# EAGLE design AntennaControl (EAGLE 4.16)
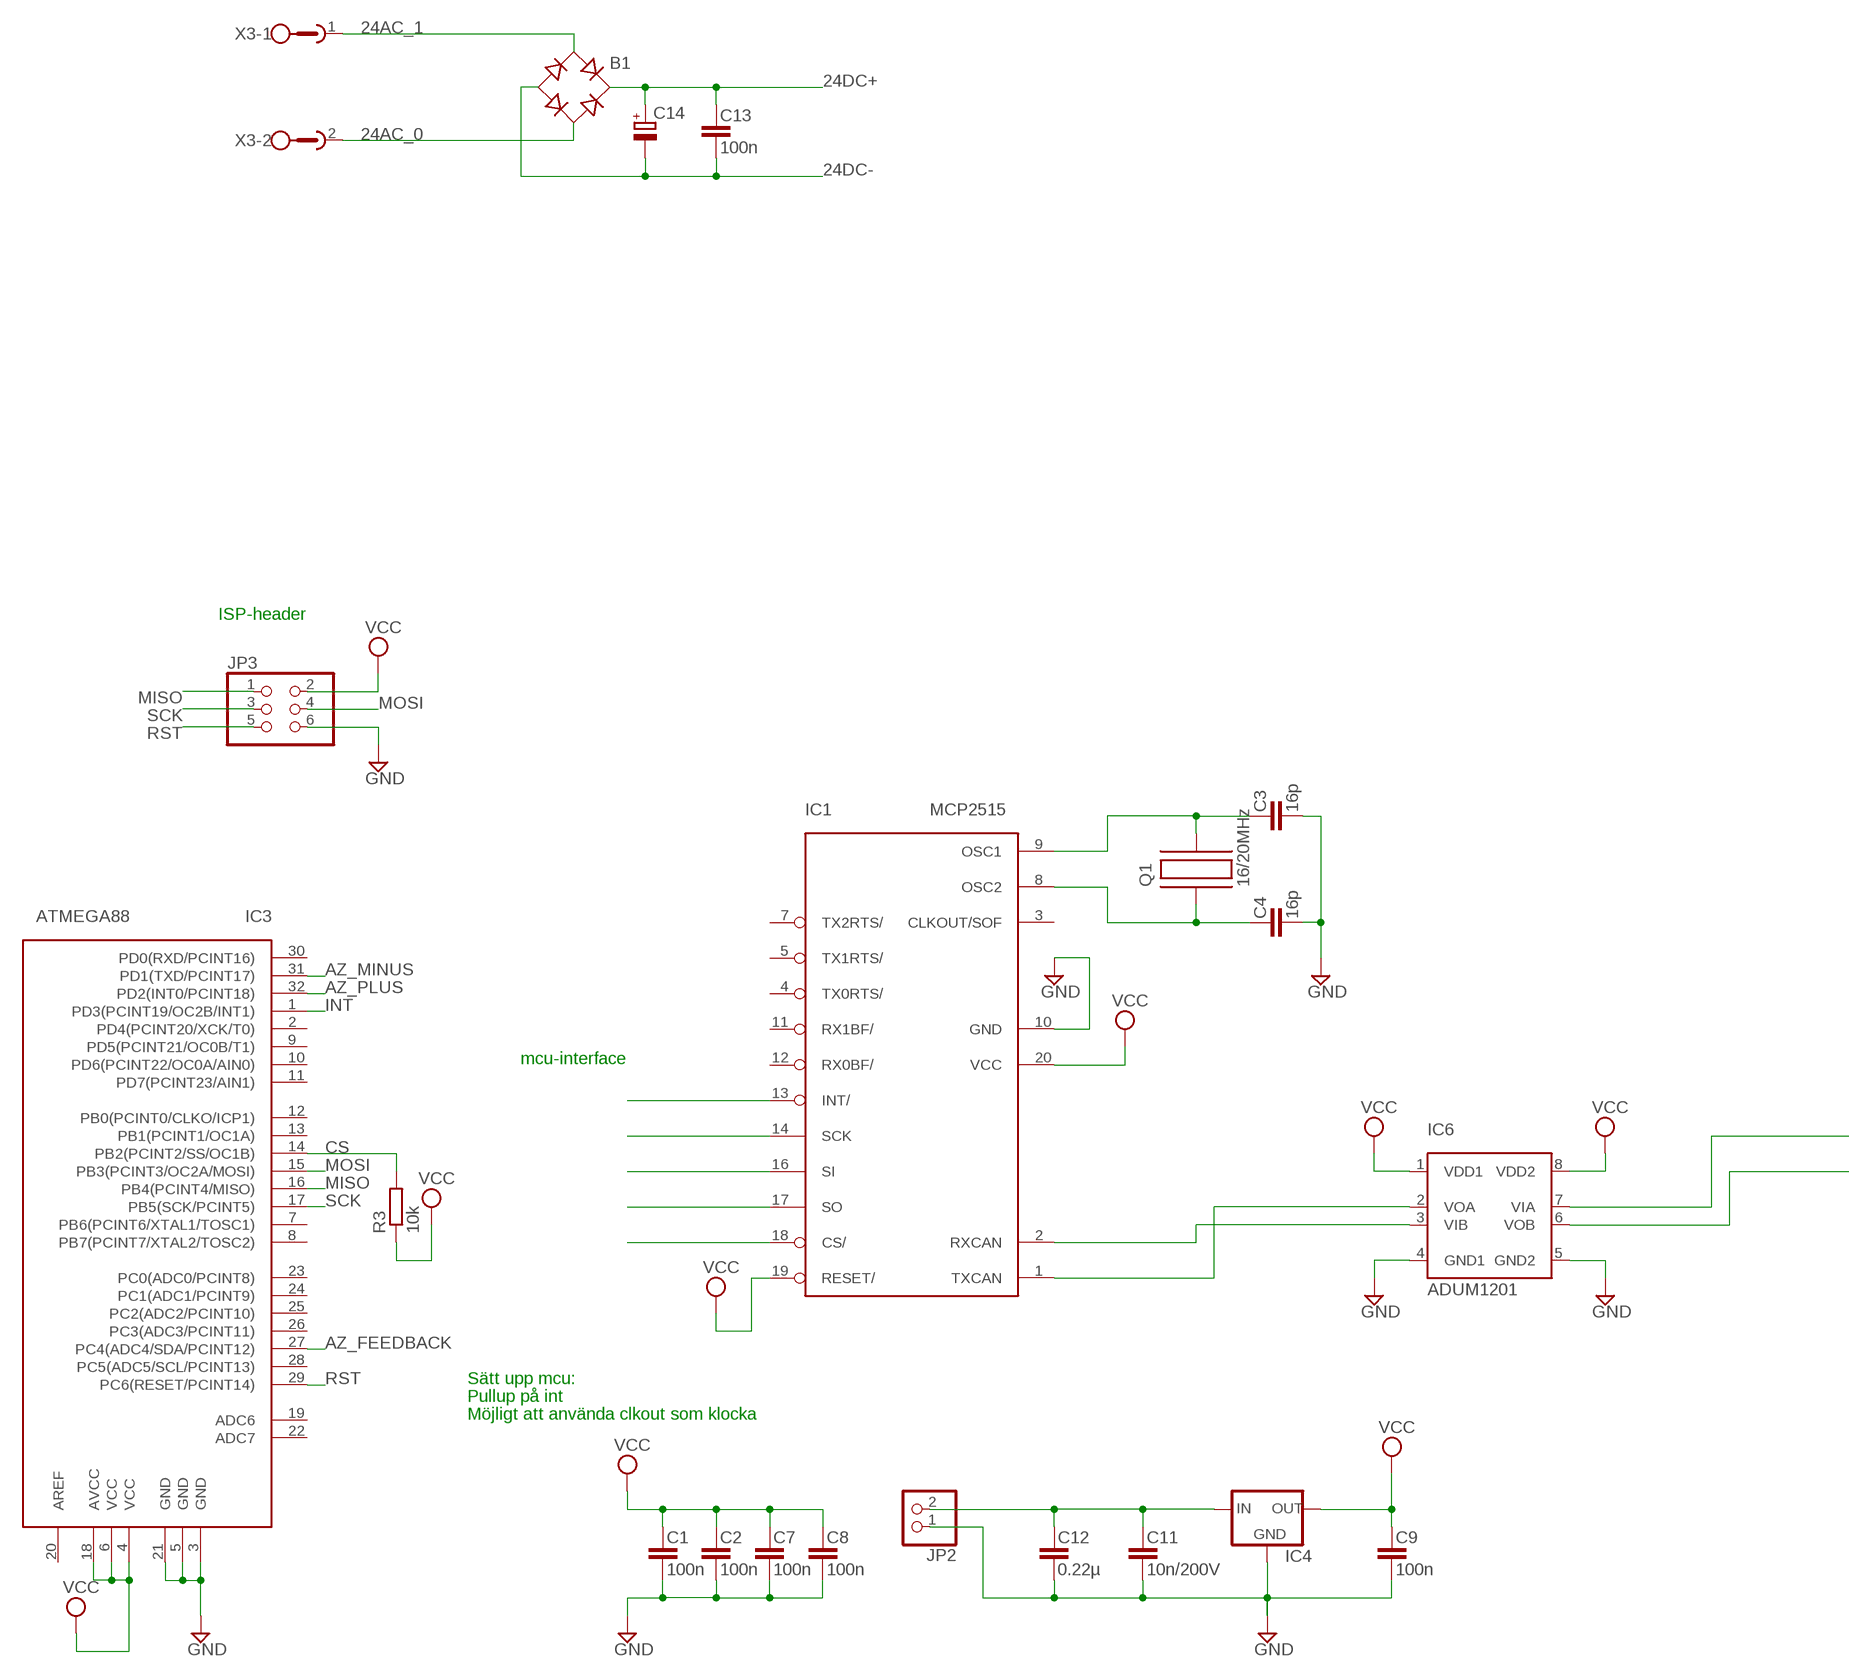
[diagram p0: schematic, sheet 1, part 1 of 2]
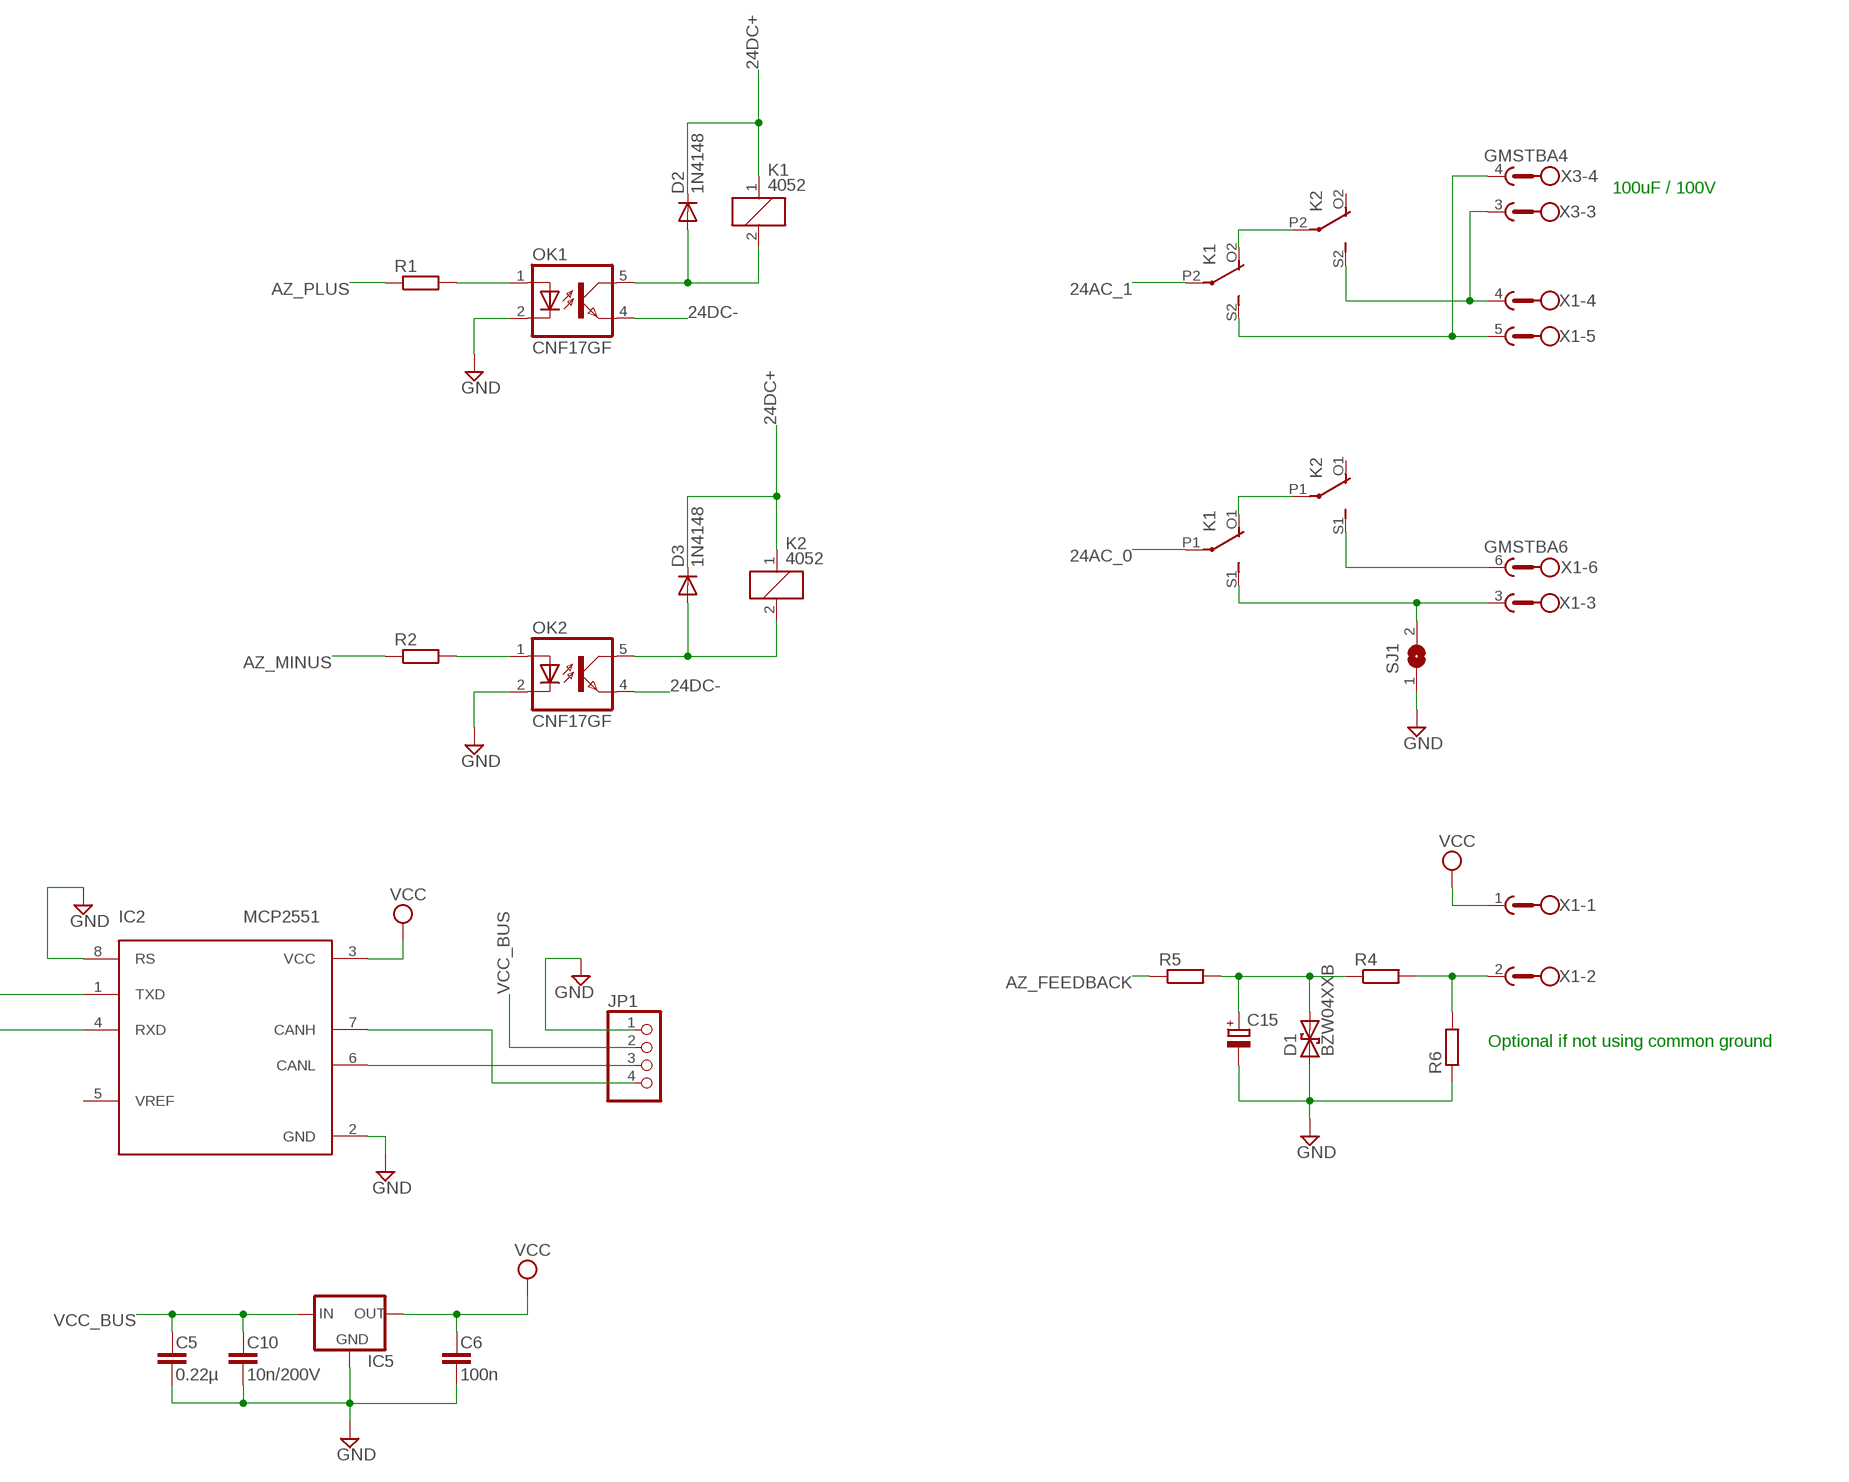
[diagram p1: schematic, sheet 1, part 2 of 2]

## Parts
B1  RB1A  [RB1A]
C1  100n  C-EU  [C0603]
C2  100n  C-EU  [C0603]
C3  16p  C-EU  [C0603]
C4  16p  C-EU  [C0603]
C5  0.22µ  C-EU  [C0603]
C6  100n  C-EU  [C0603]
C7  100n  C-EU  [C0603]
C8  100n  C-EU  [C0603]
C9  100n  C-EU  [C0603]
C10  10n/200V  C-EU  [C0603]
C11  10n/200V  C-EU  [C0603]
C12  0.22µ  C-EU  [C0603]
C13  100n  C-EU  [C0603]
C14  CPOL-EUE2.5-6  [E2,5-6]
C15  CPOL-EUE2.5-6  [E2,5-6]
D1  BZW04XXB  [F126Z12]
D2  1N4148  [DO35-10]
D3  1N4148  [DO35-10]
IC1  MCP2515  [TSSOP]
IC2  MCP2551  [SOIC]
IC3  ATMEGA88  [TQFP32]
IC4  78XXS  [78XXS]
IC5  78XXS  [78XXS]
IC6  ADUM1201  [SOIC]
JP1  PINHD-1X4  [1X04]
JP2  PINHD-1X2  [1X02]
JP3  PINHD-2X3  [2X03]
K1  4052  [F4052]
K2  4052  [F4052]
OK1  CNF17GF  [DIL06B]
OK2  CNF17GF  [DIL06B]
Q1  16/20MHz  C-MAC-LFA147E  [SMD]
R1  R-EU_R0603  [R0603]
R2  R-EU_R0603  [R0603]
R3  10k  R-EUR0603  [R0603@1]
R4  R-EU_R0603  [R0603]
R5  R-EU_R0603  [R0603]
R6  R-EU_R0603  [R0603]
SJ1  SJ  [SJ]
X1  GMSTBA6  [GMSTBA6]
X3  GMSTBA4  [GMSTBA4]

## Nets
24AC_0: B1.AC2 K1.P1(2:P) X3.2
24AC_1: B1.AC1 K1.P2(3:P) X3.1
24DC+: B1.+ C13.1 C14.+ D2.C D3.C K1.1 K2.1
24DC-: B1.- C13.2 C14.- OK1.4(EMIT) OK2.4(EMIT)
AZ_FEEDBACK: IC3.27(PC4(ADC4/SDA/PCINT12)) R5.1
AZ_MINUS: IC3.31(PD1(TXD/PCINT17)) R2.1
AZ_PLUS: IC3.32(PD2(INT0/PCINT18)) R1.1
CANH: IC2.7(CANH) JP1.4
CANL: IC2.6(CANL) JP1.3
CS: IC1.18(CS/) IC3.14(PB2(PCINT2/SS/OC1B)) R3.2
GND: C1.2 C2.2 C3.2 C4.2 C7.2 C8.2 C9.2 C11.2 C12.2 C15.- D1.A IC1.10(GND) IC3.3(GND) IC3.5(GND) IC3.21(GND) IC4.GND IC6.4(GND1) JP2.1 JP3.6 OK1.2(C) OK2.2(C) R6.1 SJ1.1
GND_BUS: C5.2 C6.2 C10.2 IC2.2(GND) IC2.8(RS) IC5.GND IC6.5(GND2) JP1.1 ; supply symbol labelled GND
INT: IC1.13(INT/) IC3.1(PD3(PCINT19/OC2B/INT1))
MISO: IC1.17(SO) IC3.16(PB4(PCINT4/MISO)) JP3.1
MOSI: IC1.16(SI) IC3.15(PB3(PCINT3/OC2A/MOSI)) JP3.4
N$1: IC2.1(TXD) IC6.7(VIA)
N$2: IC2.4(RXD) IC6.6(VOB)
N$3: IC1.2(RXCAN) IC6.3(VIB)
N$4: IC1.1(TXCAN) IC6.2(VOA)
N$5: OK1.1(A) R1.2
N$6: OK2.1(A) R2.2
N$7: D3.A K2.2 OK2.5(COL)
N$8: D2.A K1.2 OK1.5(COL)
N$9: K1.O2(3:O) K2.P2(3:P)
N$10: K1.O1(2:O) K2.P1(2:P)
N$11: R4.2 R6.2 X1.2
N$12: C3.1 IC1.9(OSC1) Q1.P$2
N$13: C4.1 IC1.8(OSC2) Q1.P$1
N$15: K2.S2(3:S) X1.4 X3.3
N$16: K1.S2(3:S) X1.5 X3.4
N$17: K2.S1(2:S) X1.6
N$18: K1.S1(2:S) SJ1.2 X1.3
N$19: C15.+ D1.C R4.1 R5.2
RST: IC3.29(PC6(RESET/PCINT14)) JP3.5
SCK: IC1.14(SCK) IC3.17(PB5(SCK/PCINT5)) JP3.3
VCC: C6.1 IC2.3(VCC) IC5.OUT IC6.8(VDD2)
VCC_BUS: C5.1 C10.1 IC5.IN JP1.2
VCC_LOCAL: C11.1 C12.1 IC4.IN JP2.2
VCC_NODE: C1.1 C2.1 C7.1 C8.1 C9.1 IC1.19(RESET/) IC1.20(VCC) IC3.4(VCC) IC3.6(VCC) IC3.18(AVCC) IC4.OUT IC6.1(VDD1) JP3.2 R3.1 X1.1 ; supply symbol labelled VCC
Unconnected: IC1.3(CLKOUT/SOF) IC1.4(TX0RTS/) IC1.5(TX1RTS/) IC1.7(TX2RTS/) IC1.11(RX1BF/) IC1.12(RX0BF/) IC2.5(VREF) IC3.2(PD4(PCINT20/XCK/T0)) IC3.7(PB6(PCINT6/XTAL1/TOSC1)) IC3.8(PB7(PCINT7/XTAL2/TOSC2)) IC3.9(PD5(PCINT21/OC0B/T1)) IC3.10(PD6(PCINT22/OC0A/AIN0)) IC3.11(PD7(PCINT23/AIN1)) IC3.12(PB0(PCINT0/CLKO/ICP1)) IC3.13(PB1(PCINT1/OC1A)) IC3.19(ADC6) IC3.20(AREF) IC3.22(ADC7) IC3.23(PC0(ADC0/PCINT8)) IC3.24(PC1(ADC1/PCINT9)) IC3.25(PC2(ADC2/PCINT10)) IC3.26(PC3(ADC3/PCINT11)) IC3.28(PC5(ADC5/SCL/PCINT13)) IC3.30(PD0(RXD/PCINT16)) K2.O1(2:O) K2.O2(3:O)

## Notes on the sheet
- 100uF / 100V
- ISP-header
- mcu-interface
- Optional if not using common ground
- Sätt upp mcu:
- Pullup på int
- Möjligt att använda clkout som klocka

## Library data of the parts
B1 = rectifier:RB1A: RECTIFIER 1 A
C1-C13 = rcl:C-EU
C14 C15 = rcl:CPOL-EU: POLARIZED CAPACITOR, European symbol
D1 = diode:BZW04XXB: DIODE uni and bidirectional supressor diode
D2 D3 = diode:1N4148: DIODE high speed (Philips)
IC1 = mcp2515:MCP2515
IC2 = mcp2551:MCP2551
IC3 = atmega88:ATMEGA88
IC4 IC5 = v-reg:78XXS: VOLTAGE REGULATOR
IC6 = adum1201:ADUM1201
JP1 = pinhead:PINHD-1X4: PIN HEADER
JP2 = pinhead:PINHD-1X2: PIN HEADER
JP3 = pinhead:PINHD-2X3: PIN HEADER
K1 K2 = relay:4052: RELAY 2 x switch, Finder
OK1 OK2 = optocoupler:CNF17GF: HEWLETT PACKARD OPTO COUPLER
Q1 = hc49-4h-smx:C-MAC-LFA147E
R1 R2 R4-R6 = rcl:R-EU_: RESISTOR, European symbol
R3 = rcl:R-EU
SJ1 = jumper:SJ: SMD solder JUMPER
X1 = con-phoenix-508:GMSTBA6: PHOENIX
X3 = con-phoenix-508:GMSTBA4: PHOENIX

## Board
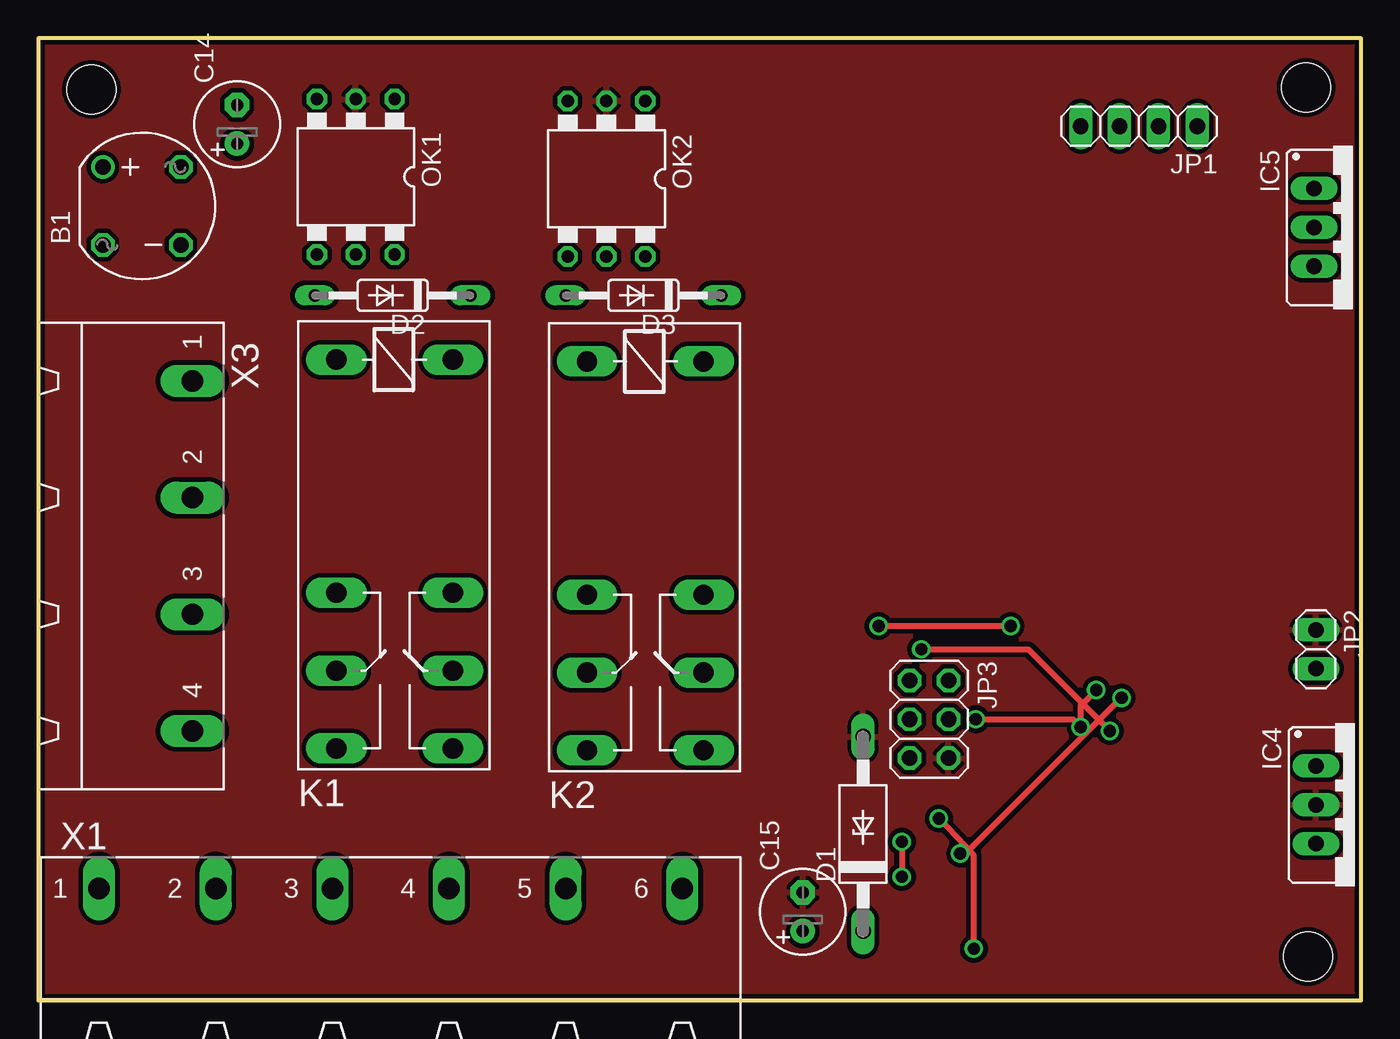
[diagram p2: board, top side]
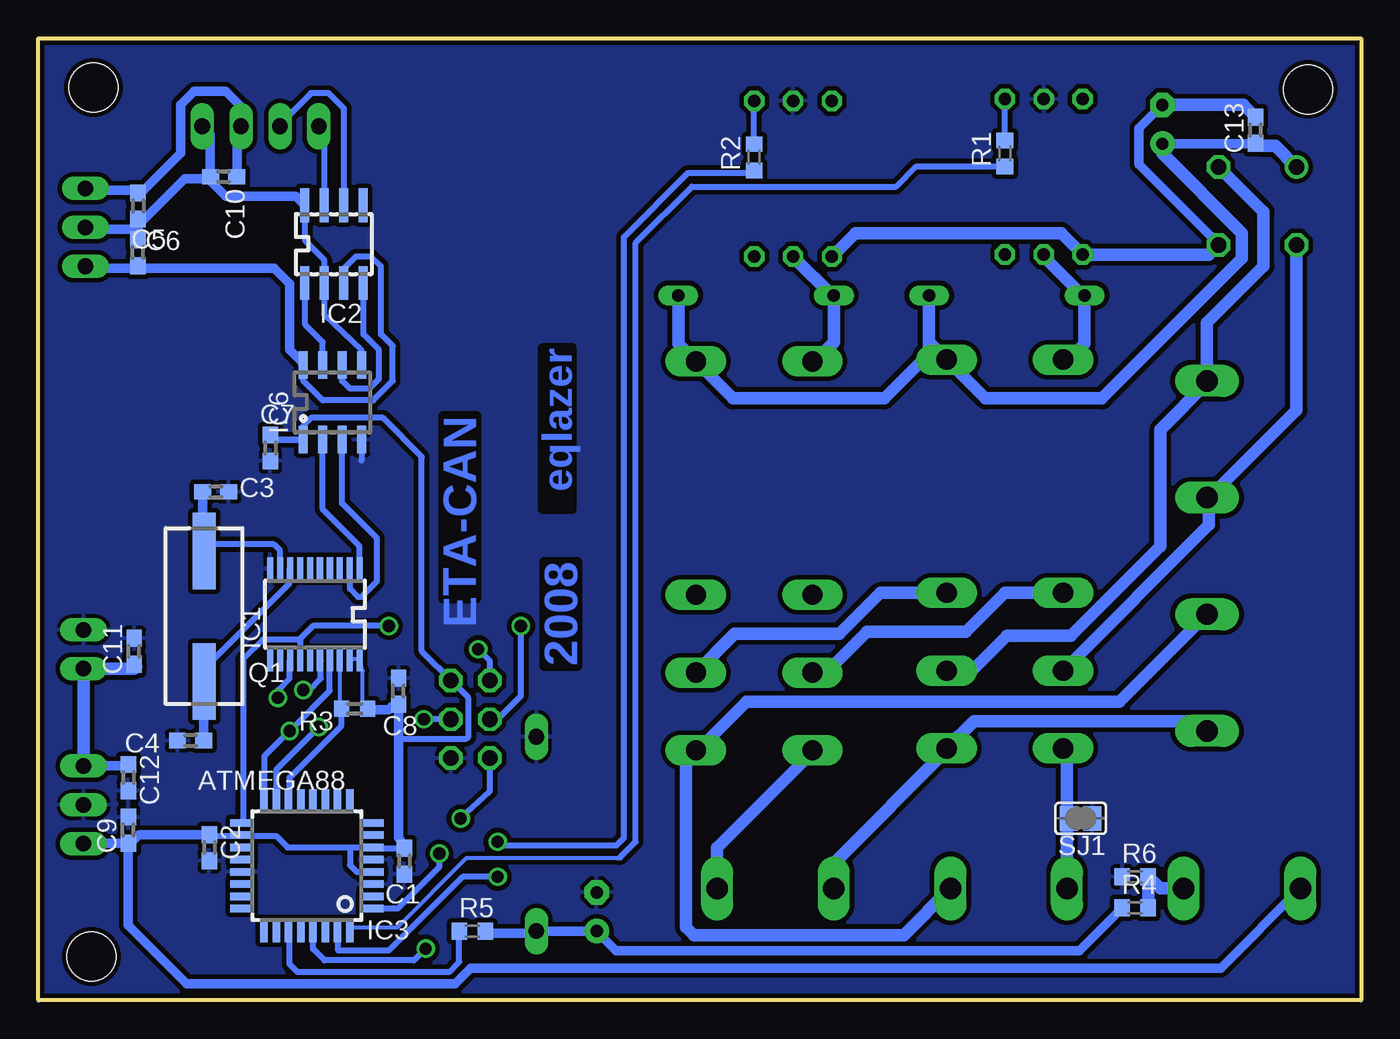
[diagram p3: board, bottom side, seen from below]

Size 86.44 x 62.85 mm. Coordinates in mm from the lower left corner, seen from the top.
Outline: 0,0 86.44,0 86.44,62.85 0,62.85 0,0
Copper layers (1*16): Top 0.035mm / dielectric 1.5mm / Bottom 0.035mm
Design rules "10mils, 0.6drill": minimum track width 10mil, minimum drill 0.6mm, track to track 10mil, track to pad 10mil, pad to pad 10mil, via to via 10mil, smd to smd 10mil, copper to edge 10mil, drill to drill 10mil, minimum pad ring 10mil, minimum via ring 8mil, stop-mask expansion 0mil, vias tented up to drill 0mil, thermal gap 10mil
Holes 3.2 mm at 3.47,59.51 82.85,59.64 82.97,2.87

### Footprints (pad centres in the part's own frame; a part is rotated, then mirrored left to right if it is on the bottom)
RB1A = drill 1.016 round: + -2.54,2.54 | drill 1.016 octagon: - 2.54,-2.54; AC1 2.54,2.54; AC2 -2.54,-2.54
C0603 = smd 1.1 x 1: 1 -0.85,0; 2 0.85,0
E2,5-6 = drill 0.813 pad 1.6 round: + -1.27,0 | drill 0.813 pad 1.6 octagon: - 1.27,0
F126Z12 = drill 1.016 long: A 6.35,0; C -6.35,0
DO35-10 = drill 0.813 long: A 5.08,0; C -5.08,0
TSSOP = smd 0.396 x 1.5: 1 -2.925,-2.975; 2 -2.275,-2.975; 3 -1.625,-2.975; 4 -0.975,-2.975; 5 -0.325,-2.975; 6 0.325,-2.975; 7 0.975,-2.975; 8 1.625,-2.975; 9 2.275,-2.975; 10 2.925,-2.975; 11 2.925,2.975; 12 2.275,2.975; 13 1.625,2.975; 14 0.975,2.975; 15 0.325,2.975; 16 -0.325,2.975; 17 -0.975,2.975; 18 -1.625,2.975; 19 -2.275,2.975; 20 -2.925,2.975
SOIC = smd 0.6 x 2.2: 1 -1.905,-2.54; 2 -0.635,-2.54; 3 0.635,-2.54; 4 1.905,-2.54; 5 1.905,2.54; 6 0.635,2.54; 7 -0.635,2.54; 8 -1.905,2.54
TQFP32 = smd 1.5 x 0.5: 1 -4.25,2.65; 2 -4.25,1.85; 3 -4.25,1.05; 4 -4.25,0.25; 5 -4.25,-0.55; 6 -4.25,-1.35; 7 -4.25,-2.15; 8 -4.25,-2.95; 17 4.25,-2.95; 18 4.25,-2.15; 19 4.25,-1.35; 20 4.25,-0.55; 21 4.25,0.25; 22 4.25,1.05; 23 4.25,1.85; 24 4.25,2.65 | smd 0.5 x 1.5: 9 -2.8,-4.4; 10 -2,-4.4; 11 -1.2,-4.4; 12 -0.4,-4.4; 13 0.4,-4.4; 14 1.2,-4.4; 15 2,-4.4; 16 2.8,-4.4; 25 2.8,4.1; 26 2,4.1; 27 1.2,4.1; 28 0.4,4.1; 29 -0.4,4.1; 30 -1.2,4.1; 31 -2,4.1; 32 -2.8,4.1
78XXS = drill 1.016 long: GND 0,-2.54; IN -2.54,-2.54; OUT 2.54,-2.54
SOIC' = smd 0.6 x 1.8: 1 -1.905,-2.44; 2 -0.635,-2.44; 3 0.635,-2.44; 4 1.905,-2.44; 5 1.905,2.44; 6 0.635,2.44; 7 -0.635,2.44; 8 -1.905,2.44
1X04 = drill 1.016 long: 1 -3.81,0; 2 -1.27,0; 3 1.27,0; 4 3.81,0
1X02 = drill 1.016 long: 1 -1.27,0; 2 1.27,0
2X03 = drill 1.016 octagon: 1 -2.54,-1.27; 2 -2.54,1.27; 3 0,-1.27; 4 0,1.27; 5 2.54,-1.27; 6 2.54,1.27
F4052 = drill 1.321 long: 1 -3.81,3.81; 2 -3.81,-3.81; O1 11.43,-3.81; O2 11.43,3.81; P1 16.51,-3.81; P2 16.51,3.81; S1 21.59,-3.81; S2 21.59,3.81
DIL06B = drill 0.813 octagon: 1 -2.54,-5.08; 2 0,-5.08; 3 2.54,-5.08; 4 2.54,5.08; 5 0,5.08; 6 -2.54,5.08
SMD = smd 5 x 1.5: P$1 4.25,0; P$2 -4.25,0
R0603 = smd 1 x 1.1: 1 -0.85,0; 2 0.85,0
R0603@1 = smd 0.991 x 1.016: 1 -0.85,0; 2 0.85,0
SJ = smd 1.168 x 1.6: 1 -0.762,0; 2 0.762,0
GMSTBA6 = drill 1.397 long: 1 -19.05,5.08; 2 -11.43,5.08; 3 -3.81,5.08; 4 3.81,5.08; 5 11.43,5.08; 6 19.05,5.08
GMSTBA4 = drill 1.397 long: 1 -11.43,5.08; 2 -3.81,5.08; 3 3.81,5.08; 4 11.43,5.08

### Placement (x,y rotation side)
B1  6.77,51.89 0 top
C1  62.53,9.09 270 bottom
C2  75.27,9.98 270 bottom
C3  74.84,33.22 0 bottom
C4  76.5,16.97 180 bottom
C5  79.92,51.89 270 bottom
C6  79.92,48.85 90 bottom
C7  71.28,36.08 270 bottom
C8  62.9,20.2 90 bottom
C9  80.56,11.13 90 bottom
C10  74.34,53.8 180 bottom
C11  80.18,22.81 90 bottom
C12  80.56,14.56 270 bottom
C13  6.9,56.85 90 bottom
C14  13,57.23 90 top
C15  49.95,5.79 90 top
D1  53.89,10.87 90 top
D2  23.16,46.05 180 top
D3  39.54,46.05 180 top
IC1  68.37,25.23 180 bottom
IC2  67.13,49.4 0 bottom
IC3  68.89,8.65 180 bottom
IC4  86.02,12.78 270 top
IC5  85.89,50.5 270 top
IC6  ADUM1201  [SOIC']  67.22,39.07 0 bottom
JP1  71.92,57.1 180 top
JP2  83.48,22.94 270 top
JP3  58.21,18.36 270 top
K1  23.28,38.05 270 top
K2  39.67,37.92 270 top
OK1  20.74,53.8 180 top
OK2  37.13,53.67 180 top
Q1  75.61,25.1 270 bottom
R1  23.28,55.32 90 bottom
R2  39.67,55.07 90 bottom
R3  65.78,19.05 180 bottom
R4  14.77,6.05 0 bottom
R5  58.08,4.52 0 bottom
R6  14.77,8.08 0 bottom
SJ1  18.33,11.89 180 bottom
X1  23.03,2.24 0 top
X3  4.99,29.03 270 top

### Tracks (layer width: path | path; a pad name or v marks a point on that pad's centre or on a via)
24AC_0
  Bottom 0.406: X3.2 9.95,32.97 9.95,32.84
  Bottom 0.813: 9.95,32.84 X3.2 | B1.AC2 4.23,38.56 9.95,32.84 | 9.95,32.84 9.95,31.06 K1.P1
24AC_1
  Bottom 0.406: X3.1 10.2,40.46
  Bottom 0.813: B1.AC1 6.39,51.51 6.39,47.96 10.07,44.27 X3.1 | X3.1 10.07,40.21 | K1.P2 25.44,21.54 23.16,23.83 18.96,23.83 13.12,29.67 13.12,37.29 9.95,40.46 X3.1
24DC+
  Bottom 0.406: 7.03,55.83 7.03,55.87 C13.1
  Bottom 0.61: 7.03,55.87 7.11,55.96 C14.+
  Bottom 0.813: C13.1 6.77,55.87 6.77,55.83 5.63,55.83 B1.+ | C14.+ 13,55.32 7.79,50.12 7.79,48.46 16.93,39.32 24.55,39.32 26.97,41.73 | 26.97,41.73 K1.1 | 28.24,43 D2.C | 26.97,41.73 28.24,43 | D3.C 44.62,42.88 K2.1 41.06,39.32 31.16,39.32 28.24,42.24 28.24,43
24DC-
  Bottom 0.254: B1.- 9.82,49.91
  Bottom 0.61: 9.82,49.91 14.52,54.61 14.52,56.97 C14.-
  Bottom 0.813: C13.2 7.7,58.5 C14.- | B1.- 9.95,48.72 OK1.4 19.6,50.12 33.06,50.12 OK2.4
AZ_FEEDBACK
  Bottom 0.406: 70.15,4.52 70.12,4.52 IC3.27 70.05,4.55 70.02,4.52 70.02,2.36 69.51,1.85 59.61,1.85 58.93,2.53 R5.1
AZ_MINUS  (via drill 0.8)
  Top 0.406: v56.43,10.36 v56.43,8.08
  Bottom 0.406: R2.1 39.83,54.05 43.98,54.05 48.18,49.86 48.18,10.62 48.68,10.11 56.18,10.11 v56.43,10.36 | v56.43,8.08 58.72,8.08 63.54,3.25 66.84,3.25 66.84,4.52 66.86,4.52 IC3.31
AZ_PLUS
  Bottom 0.254: IC3.32 65.85,4.75 63.01,4.75 58.49,9.27 48.58,9.27 48.43,9.35
  Bottom 0.406: R1.1 29.09,54.47 30.4,53.16 43.73,53.16 47.41,49.48 47.41,10.36 48.43,9.35
CANH
  Bottom 0.406: 67.73,51.91 67.73,51.89 | IC2.7 67.73,51.91 | JP1.4 67.73,56.72 67.73,51.91
CANL
  Bottom 0.406: IC2.6 66.46,51.97 66.46,58.24 67.48,59.26 68.62,59.26 70.78,57.1 JP1.3
CS
  Bottom 0.254: R3.2 66.72,19.53 66.72,21.52 IC1.18
  Bottom 0.406: R3.2 66.63,17.95 70.02,14.56 70.02,13.03 70.04,13.05 IC3.14
GND
  Bottom 0.406: IC6.4 65.32,35.26
  pour Bottom (isolate 0.305): 0.12,62.74 86.42,62.74 86.42,0.1 24.38,0.1 0.12,0.1
  pour Top (isolate 0.305): 0.17,62.69 99.1,62.69 99.1,0.08 0.17,0.08
GND_BUS
  Bottom 0.406: 75.35,53.67 75.31,53.67 C10.2 | 80.05,51 79.96,51 C5.2 | IC6.5 65.32,42.5 67.73,44.78 67.73,46.89 | 67.73,46.89 IC2.2 | 67.73,46.89 67.73,48.34 69,49.61 69,51.97 | 69,51.97 69,52.02 | 69,51.97 IC2.8
  Bottom 0.61: 75.23,53.76 75.23,53.67 | 75.23,53.76 C10.2 75.23,53.8 75.35,53.67 | JP1.1 75.23,56.59 75.23,53.76 | IC5.GND 83.23,50.37 80.05,50.37 | 80.05,50.37 79.92,50.37 79.92,50.62 | 79.92,51.13 C5.2 79.92,50.62 | C6.2 80.05,49.82 80.05,50.37 | IC2.8 69.62,52.53 74.21,52.53 75.35,53.67 | 75.35,53.67 76.88,53.67 79.92,50.62
INT  (via drill 0.8)
  Top 0.406: v60.24,9.6 60.62,9.6 v70.78,19.76
  Bottom 0.406: IC3.1 62.95,6 60.24,8.71 v60.24,9.6 | v70.78,19.76 70.78,20.27 70.02,21.03 70.02,22.18 69.99,22.2 IC1.13
MISO  (via drill 0.8)
  Top 0.406: v57.7,22.94 64.69,22.94 v70.02,17.6
  Bottom 0.406: IC1.17 67.39,20.23 69.77,17.86 v70.02,17.6 71.67,15.95 71.67,13.16 71.69,13.14 IC3.16 | JP3.1 56.94,22.18 v57.7,22.94
MOSI  (via drill 0.8)
  Top 0.406: v69.13,20.27 68.11,19.25 v68.11,17.86 67.61,18.36 v61.26,18.36
  Bottom 0.406: IC3.15 70.89,15.08 v68.11,17.86 | v69.13,20.27 68.75,20.27 67.99,21.03 67.99,22.18 68.04,22.23 IC1.16 | JP3.4 v61.26,18.36
N$1
  Bottom 0.406: IC6.7 67.86,43 69,44.15 69,46.89 | 69,46.89 69,46.94 | 69,46.89 IC2.1
N$2
  Bottom 0.406: IC6.6 66.59,40.46 66.08,39.96 64.81,39.96 64.18,40.59 64.18,42.5 65.19,43.51 65.19,46.89 | 65.19,46.89 65.19,46.94 | 65.19,46.89 IC2.4
N$3
  Bottom 0.406: IC6.3 66.59,32.46 64.3,30.18 64.3,27.38 65.32,26.37 65.57,26.37 66.08,26.87 66.08,28.14 66.09,28.15 IC1.2
N$4
  Bottom 0.406: IC6.2 67.86,32.08 65.45,29.67 65.45,28.27 65.44,28.27 IC1.1
N$5
  Bottom 0.406: R1.2 OK1.1 23.41,59.01
N$6
  Bottom 0.406: 39.67,58.88 OK2.1 R2.2
N$7
  Bottom 0.813: OK2.5 34.46,45.92 D3.A 34.46,43 35.86,41.61 K2.2
N$8
  Bottom 0.813: OK1.5 20.74,48.59 18.08,45.92 D2.A 18.08,42.88 19.22,41.73 19.35,41.86 K1.2
N$9
  Bottom 0.813: K1.O2 31.41,26.62 34.08,23.95 40.94,23.95 K2.P2
N$10
  Bottom 0.813: K1.O1 23.28,26.62 25.82,24.08 32.3,24.08 35.09,21.29 35.86,21.29 K2.P1
N$11
  Bottom 0.813: X1.2 13.12,7.32 13.88,8.08 R6.2 13.92,6.08 13.88,6.05 R4.2
N$12
  Bottom 0.406: IC1.9 70.64,29.4 71.03,29.79 75.23,29.79 75.61,29.41 Q1.P$2
  Bottom 0.61: Q1.P$2 75.61,29.29 75.7,29.38 C3.1
N$13
  Bottom 0.406: 75.48,21.03 75.48,21.79 70.02,27.25 70.02,28.17 IC1.8
  Bottom 0.61: 75.61,20.9 75.48,21.03 | 75.61,20.9 Q1.P$1 | C4.1 75.65,20.87 75.61,20.9
N$15
  Bottom 0.813: X3.3 15.79,19.51 40.17,19.51 43.35,16.33 | 43.35,16.33 43.48,16.21 K2.S2 43.35,16.33 | X1.4 29.89,4.27 43.6,4.27 44.11,4.78 44.11,16.33 43.35,16.33
N$16
  Bottom 0.813: X3.4 10.71,18.24 25.32,18.24 K1.S2 26.97,16.46 34.46,8.97 X1.5
N$17
  Bottom 0.813: 35.73,16.33 35.6,16.46 | 35.73,16.33 K2.S1 | X1.6 42.08,9.98 35.73,16.33
N$18
  Bottom 0.813: X1.3 19.22,12.14 | 19.22,12.14 19.22,16.21 K1.S1 | SJ1.2 19.09,12.02 19.22,12.14
N$19
  Bottom 0.61: R4.1 18.42,3.25 48.68,3.25 C15.+ D1.C | D1.C 54.02,4.52 | 57.36,4.39 57.45,4.39 | 57.36,4.39 R5.2 | D1.C 54.02,4.39 57.36,4.39
RST  (via drill 0.8)
  Top 0.406: v61.13,3.38 61.13,9.48 v58.84,11.89
  Bottom 0.406: IC3.29 68.49,3.37 67.73,2.62 61.89,2.62 v61.13,3.38 | 56.94,15.95 JP3.5 56.94,13.67 v58.84,11.89
SCK  (via drill 0.8)
  Top 0.406: v54.91,24.46 v63.54,24.46
  Bottom 0.406: IC1.14 69.34,23.57 69.38,23.57 | 69.38,23.57 71.8,23.57 73.07,22.3 73.07,11.63 73.1,11.6 IC3.17 | JP3.3 56.43,18.36 54.91,19.89 v54.91,24.46 | v63.54,24.46 68.5,24.46 69.38,23.57
VCC
  Bottom 0.406: 80.05,47.96 79.96,47.96 C6.1 | IC2.3 66.5,47.8 65.7,48.59 64.69,48.59 64.05,47.96 64.05,43.51 63.29,42.75 63.29,40.46 64.56,39.19 67.86,39.19 69.13,40.46 IC6.8 69.23,41.51 69.26,41.48
  Bottom 0.61: 79.92,47.83 C6.1 | IC5.OUT 83.23,47.83 79.92,47.83 | 79.92,47.83 71.03,47.83 70.02,46.81 70.02,42.5 69.13,41.61 IC6.8
VCC_BUS
  Bottom 0.406: IC5.IN 83.48,53.04 | C5.1 80.22,53.04
  Bottom 0.61: 73.45,53.76 73.45,53.67 | 73.45,53.76 C10.1 | 73.45,53.76 73.45,56.85 JP1.2 73.19,58.37 74.21,59.39 76.24,59.39 77.13,58.5 77.13,55.32 79.54,52.91 79.8,52.91 | 79.8,52.91 79.8,52.87 C5.1 | IC5.IN 83.23,52.91 79.8,52.91
VCC_LOCAL
  Bottom 0.61: 80.47,15.41 80.43,15.44 | C12.1 80.47,15.41 | IC4.IN 80.56,15.32 80.47,15.41
  Bottom 0.813: JP2.2 83.48,21.79 | IC4.IN JP2.2 | C11.1 80.18,21.92 80.05,21.79 80.18,21.67 JP2.2
VCC_NODE
  Bottom 0.254: IC1.19 65.9,22.28 65.6,22.28 IC1.20 65.24,21.52 65.24,19.53 R3.1 64.48,19.18 | 63.36,19.18 C8.1 62.8,18.82 | C1.1 62.8,10.49
  Bottom 0.406: C7.1 71.28,36.92 71.29,36.91 71.01,36.63 | 71.01,36.63 IC6.1 | 71.01,36.63 69.16,36.63 69.13,36.65 69.13,37.54 68.62,38.05 63.92,38.05 61.38,35.51 61.38,22.81 59.35,20.78 | C1.1 64.65,9.94 64.69,9.98 64.67,10 IC3.6 66.08,10 | 66.08,10 70.16,10 70.91,10.75 73.19,10.75 | 73.19,10.75 IC3.18 | IC3.18 | IC3.4 65.64,8.4 66.08,8.84 66.08,10 | C2.1 75.27,10.79 75.23,10.75 73.19,10.75 | 59.35,20.78 58.34,19.76 58.34,17.22 58.46,17.09 62.91,17.09 | 59.35,20.78 JP3.2
  Bottom 0.61: C9.1 80.47,10.28 80.43,10.24 79.84,10.83 C2.1 | IC4.OUT 83.35,10.24 83.31,10.28 C9.1 | X1.1 9.19,2.11 58.21,2.11 59.22,1.09 76.75,1.09 80.56,4.9 C9.1 | C8.1 62.91,19.38 | C8.1 | 62.8,10.49 62.91,10.59 62.91,17.09 C8.1 | 64.98,19 65.07,19 | 64.98,19 R3.1 | 63.36,19.18 63.54,19 64.98,19

### Text on the board
Bottom: eqlazer | ETA-CAN | 2008